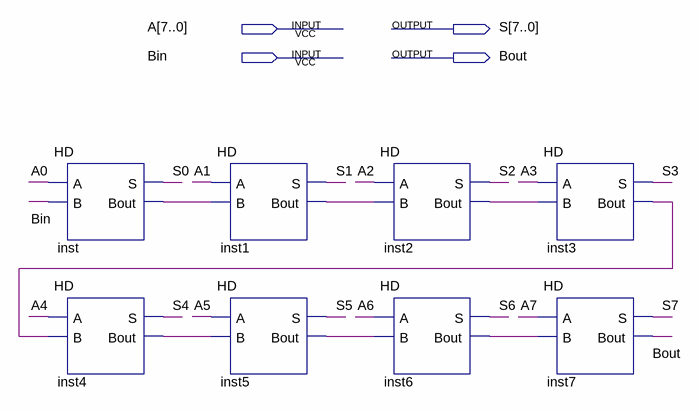
[diagram p0: schematic sheet]
// Quartus schematic DEC8.bdf as structural Verilog: 8 symbols, 4 pins
module DEC8 (
  input  [7:0] A,
  input  Bin,
  output [7:0] S,
  output Bout
);

  wire inst1_bout, inst2_bout, inst3_bout, inst4_bout, inst5_bout, inst6_bout, inst_bout;

  HD inst (.A(A[0]), .B(Bin), .S(S[0]), .Bout(inst_bout));
  HD inst4 (.A(A[4]), .B(inst3_bout), .S(S[4]), .Bout(inst4_bout));
  HD inst1 (.A(A[1]), .B(inst_bout), .S(S[1]), .Bout(inst1_bout));
  HD inst5 (.A(A[5]), .B(inst4_bout), .S(S[5]), .Bout(inst5_bout));
  HD inst2 (.A(A[2]), .B(inst1_bout), .S(S[2]), .Bout(inst2_bout));
  HD inst6 (.A(A[6]), .B(inst5_bout), .S(S[6]), .Bout(inst6_bout));
  HD inst3 (.A(A[3]), .B(inst2_bout), .S(S[3]), .Bout(inst3_bout));
  HD inst7 (.A(A[7]), .B(inst6_bout), .S(S[7]), .Bout(Bout));
endmodule
